# Altium schematic sheet RS422.SchDoc
size 420 x 297 mm; Address1: Address1; Address2: Address2; Address3: Address3; Address4: Address4; SheetNumber: 1; Scale: 1:1; Разраб.: Иванов; Обозначение документа: АБВГ.123456.001 Э3; Пров.: Петров; Утв.: Сидоров; Наименование организации: ОАО "Концерн "МПО-Гидроприбор"; Перв. применение: АБВГ.123456.000; Наименование изделия 1: Плата; Наименование изделия 2: Схема электрическая; Наименование изделия 3: принципиальная; Нач. отд.: Нач. отд.; Фамилия нач. отд.: Сидоров
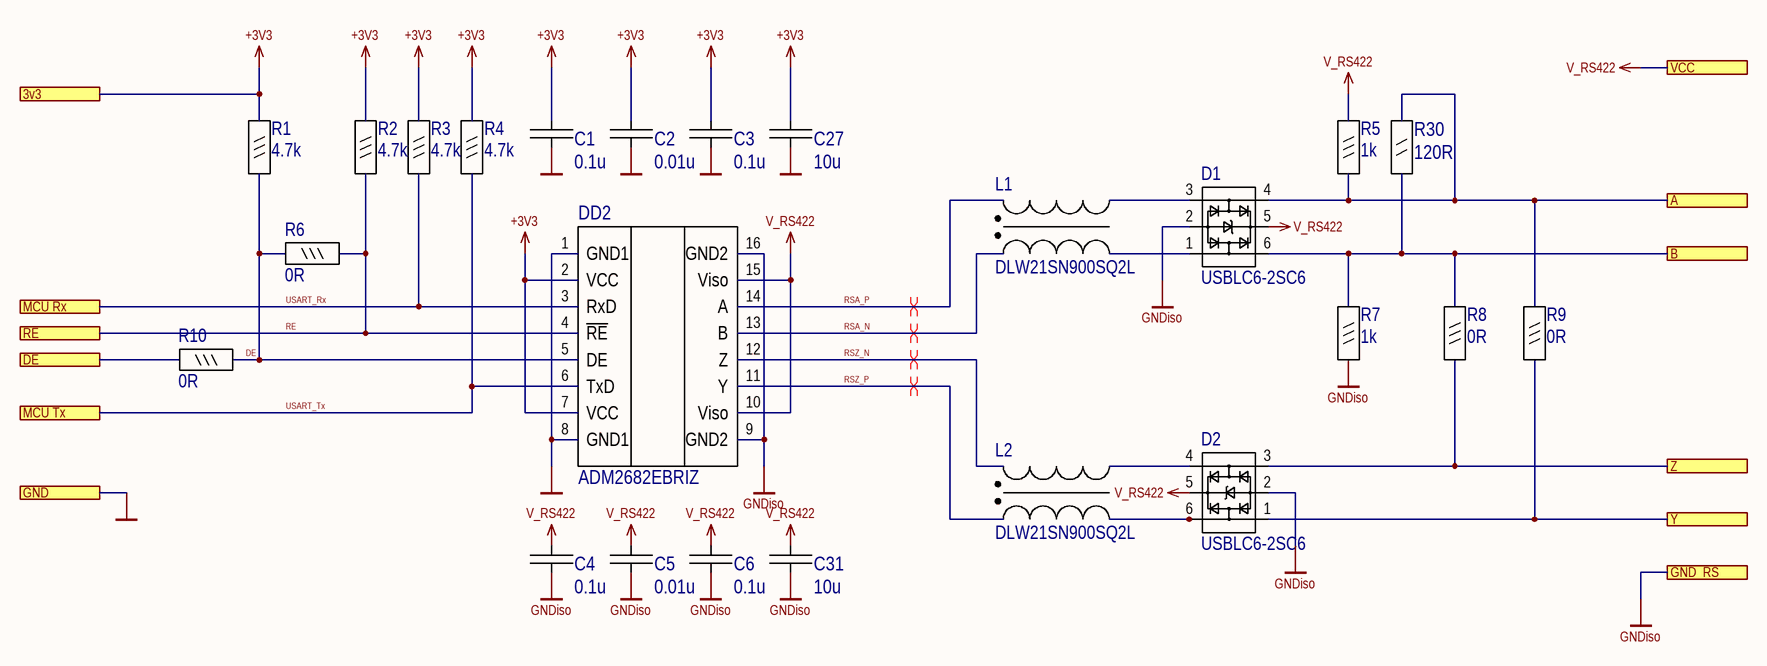
[diagram p0: RS422.SchDoc]

## Parts
C1  0.1u  [C0603_IPC]
C2  0.01u  [C0603_IPC]
C3  0.1u  [C0603_IPC]
C4  0.1u  [C0603_IPC]
C5  0.01u  [C0603_IPC]
C6  0.1u  [C0603_IPC]
C27  10u  [C0805_IPC]
C31  10u  [C0805_IPC]
D1  USBLC6-2SC6  [SOT23-6]
D2  USBLC6-2SC6  [SOT23-6]
DD2  ADM2682EBRIZ  [SOIC16W]
L1  DLW21SN900SQ2L  [DLW21S 0805]
L2  DLW21SN900SQ2L  [DLW21S 0805]
R1  4.7k  [R0603]
R2  4.7k  [R0603]
R3  4.7k  [R0603]
R4  4.7k  [R0603]
R5  1k  [R0603]
R6  0R  [R0603]
R7  1k  [R0603]
R8  0R  [R0603]
R9  0R  [R0603]
R10  0R  [R0603]
R30  120R  [R0805]

## Ports
3v3, A, B, DE, GND, GND_RS, MCU Rx, MCU Tx, RE, VCC, Y, Z

## Nets
+3V3: C1.1 C2.1 C3.1 C27.1 DD2.2(VCC) DD2.7(VCC) R1.2 R2.2 R3.2 R4.2 ; port 3v3
GND: C1.2 C2.2 C3.2 C27.2 DD2.1(GND1) DD2.8(GND1) ; port GND
GNDiso: C4.2 C5.2 C6.2 C31.2 D1.2(GND) D2.2(GND) DD2.9(GND2) DD2.16(GND2) R7.1 ; port GND_RS
V_RS422: C4.1 C5.1 C6.1 C31.1 D1.5(Vbus) D2.5(Vbus) DD2.10(Viso) DD2.15(Viso) R5.2 ; port VCC
A: D1.4(IO2) R5.1 R9.2 R30.2 ; port A
B: D1.6(IO1) R7.2 R8.2 R30.1 ; port B
DE: DD2.5(DE) R1.1 R6.1 R10.2
DE: R10.1 ; port DE  [a separate net that carries the same name]
RE: DD2.4(~{RE}) R2.1 R6.2 ; port RE
RSA_N: DD2.13(B) L1.1
RSA_P: DD2.14(A) L1.4
RSZ_N: DD2.12(Z) L2.4
RSZ_P: DD2.11(Y) L2.1
USART_Rx: DD2.3(RxD) R3.1 ; port MCU Rx
USART_Tx: DD2.6(TxD) R4.1 ; port MCU Tx
Y: D2.1(IO1) R9.1 ; port Y
Z: D2.3(IO2) R8.1 ; port Z
NetD1_1: D1.1(IO1) L1.2
NetD1_3: D1.3(IO2) L1.3
NetD2_4: D2.4(IO2) L2.3
NetD2_6: D2.6(IO1) L2.2

## Layout directives
differential pair: RSA_N, RSA_P, RSZ_N, RSZ_P

## Notes on the sheet
- Подп. и дата
- Инв. № дубл.
- Взам. инв. №
- Инв. № подл.
- Изм.
- Лист
- № докум.
- Подп.
- Дата
- Копировал
- Формат А3

## Library data of the parts
C1 C3 C4 C6 = 0.1u 50V: 0.1uF ±10% 50V Ceramic Capacitor X7R 0603 (1608 Metric); MPN: CL10B104KB8NNND; Manufacturer: Samsung; Tolerance: 0,1; PartNumber: 0.1u 50V; Value: 0.1u; Voltage/Power: 50V; LibraryPath: _library\sch\cap.schlib; FootprintPath: _library\pcb\capSmd.pcblib; ComponentLink2URL: https://www.digikey.com/product-detail/en/yageo/CC0603KRX7R9BB104/311-1344-2-ND/2103082; ComponentLink2Description: site; Type: X7R; price elitan 1000pc: 0.63; price terra 1000pc: 0.65
C2 C5 = 0.01u 50V: 0.01uF ±10% 50V Ceramic Capacitor X7R 0603 (1608 Metric); MPN: CC0603KRX7R9BB103; Manufacturer: Yageo; Tolerance: 0,1; PartNumber: 0.01u 50V; Value: 0.01u; Voltage/Power: 50V; LibraryPath: _library\sch\cap.schlib; FootprintPath: _library\pcb\capSmd.pcblib; ComponentLink2URL: https://www.digikey.com/product-detail/en/yageo/CC0603KRX7R9BB103/311-1085-2-ND/302819; ComponentLink2Description: site; Type: X7R; price elitan 1000pc: 0.54; price terra 1000pc: 0.62
C27 C31 = 10u 10V: 10µF ±10% 10V Ceramic Capacitor X7R 0805 (2012 Metric); MPN: CL21B106KPQNNNE; Manufacturer: Yageo; Name: 10u 10V; Tolerance: 0,1; Value: 10u; Voltage/Power: 10V; LibraryPath: _library\sch\cap.schlib; FootprintPath: _library\pcb\capSmd.pcblib; ComponentLink2URL: https://www.digikey.com/product-detail/en/samsung-electro-mechanics/CL21B106KPQNNNE/1276-1764-2-ND/3887422; ComponentLink2Description: site; Type: X7R; price elitan 1000pc: 2.23; price terra 1000pc: 2.5
D1 D2 = USBLC6-2SC6: TVS DIODE 5.25V 17V SOT23-6; Component Package: SOT23-6L; Component Name: USBLC6-2SC6; HelpURL: C:\DATASHEET\Diode\usblc6-2.pdf; Name: USBLC6-2SC6; MPN: USBLC6-2SC6; LibraryPath: _library\sch\diods.schlib; FootprintPath: _library\pcb\diods.pcblib; ComponentLink1URL: D:\_library\pdf\diods\BAS70_BAS170SERIES-DS-v01_01-en.pdf; ComponentLink1Description: datasheet; ComponentLink2URL: https://www.st.com/content/ccc/resource/technical/document/datasheet/06/1d/48/9c/6c/20/4a/b2/CD00050750.pdf/files/CD00050750.pdf/jcr:content/translations/en.CD00050750.pdf; ComponentLink2Description: site; ComponentLink3URL: D:\_library\pdf\diods\BAS70_BAS170SERIES-DS-v01_01-en.pdf; ComponentLink3Description: datasheet; ComponentLink4URL: http://www.diodes.com/?q=catalog/Schottky___SBR_Rectifiers_6/B560C_4305; ComponentLink4Description: site
DD2 = ADM2682E: OPTOISO 5KV TRANSCEIVER 16SOIC; Component Package: SOIC16 Narrow 3.90mm Width; Component Name: ADM2682EBRIZ; HelpURL: C:\DATASHEET\Driver\ADM2682E.pdf; ComponentLink1Description: DataSheet; ComponentLink1URL: C:\DATASHEET\Driver\ADM2682E.pdf; Name: ADM2682E; MPN: ADM2682EBRIZ; ComponentLink2URL: https://www.analog.com/media/en/technical-documentation/data-sheets/ADM2682E_2687E.pdf; ComponentLink2Description: site; ComponentLink3URL: http://pulsarnpp.ru/index.php/2-uncategorised/236-seriya-1432nov; ComponentLink3Description: 1432УД8; ComponentLink4URL: http://www.ti.com/product/opa694/description; ComponentLink4Description: OPA658
L1 L2 = DLW21SN_SQ: CMC 330MA 2LN 90 OHM SMD; Value: 100u; MPN: DLW21SN900SQ2L; Name: DLW21SN_SQ; LibraryPath: _library\sch\inductors.schlib; FootprintPath: _library\pcb\inductor.pcblib; ComponentLink1URL: D:\_library\pdf\inductor\sinphase\dlp11sn900sl2l.pdf; ComponentLink1Description: datasheet; ComponentLink2URL: https://www.murata.com/en-us/products/productdata/8796757917726/EFLC0003.pdf; ComponentLink2Description: site; ComponentLink3URL: D:\_library\pdf\inductor\sinphase\tdk-mcz2010ah900_ed20b2fa0b.pdf; ComponentLink3Description: TDK; ComponentLink4URL: D:\_library\pdf\inductor\sinphase\tdk-mcz2010ah900_ed20b2fa0b.pdf
R1-R4 = 4k7 5%: 4.7 kOhms ±5% 0.1W, 1/10W Chip Resistor 0603 (1608 Metric) Moisture Resistant Thick Film; MPN: RC0603JR-074k7L; Manufacturer: yageo; Name: 4k7 5%; Voltage/Power: 0.063; Value: 4.7k; Tolerance: 5%; ComponentLink2URL: https://www.digikey.com/product-detail/en/yageo/RC0603JR-074K7L/311-4.7KGRTR-ND/726785; ComponentLink2Description: site; price elitan 1000pc: 0.17; price terra 1000pc: 0.15; LibraryPath: sch\res.schlib; FootprintPath: pcb\resSmd.pcblib
R5 R7 = 1k 5%: 1 kOhms ±5% 0.1W, 1/10W Chip Resistor 0603 (1608 Metric) Moisture Resistant Thick Film; MPN: RC0603JR-071kL; Manufacturer: yageo; Name: 1k 5%; Voltage/Power: 0.063; Value: 1k; Tolerance: 5%; ComponentLink2URL: https://www.digikey.com/product-detail/en/yageo/RC0603JR-071RL/311-1.0GRTR-ND/726676; ComponentLink2Description: site; price elitan 1000pc: 0.26; price terra 1000pc: 0.23; LibraryPath: sch\res.schlib; FootprintPath: pcb\resSmd.pcblib
R6 R8-R10 = 0R: 0 Ohms Jumper 0.1W, 1/10W Chip Resistor 0603 (1608 Metric) Moisture Resistant Thick Film; MPN: RC0603FR-070RL; Manufacturer: yageo; Voltage/Power: 0.063; Name: 0R; Value: 0R; Tolerance: Jumper; ComponentLink2URL: https://www.digikey.com/product-detail/en/yageo/RC0603FR-070RL/311-0.0HRTR-ND/1304008; ComponentLink2Description: site; price elitan 1000pc: 0.26; price terra 1000pc: 0.23; LibraryPath: sch\res.schlib; FootprintPath: pcb\resSmd.pcblib
R30 = 120R 5%: 120 Ohms ±5% 0.125W, 1/8W Chip Resistor 0805 (2012 Metric) Moisture Resistant Thick Film; MPN: RC0805JR-07120RL; Manufacturer: yageo; Name: 120R 5%; Tolerance: 0,05; Voltage/Power: 0.125; Value: 120R; ComponentLink2URL: https://www.digikey.com/product-detail/en/yageo/RC0805JR-07120RL/311-120ARTR-ND/728247; ComponentLink2Description: site; price elitan 1000pc: 0.26; price terra 1000pc: 0.23; LibraryPath: _library\sch\res.schlib; FootprintPath: _library\pcb\resSmd.pcblib